# Altium schematic sheet Connectors.SchDoc
size B; Organization: Altium Limited; Address1: L3, 12a Rodborough Rd; Address2: Frenchs Forest; Address3: NSW; Address4: Australia 2086; SheetNumber: 7
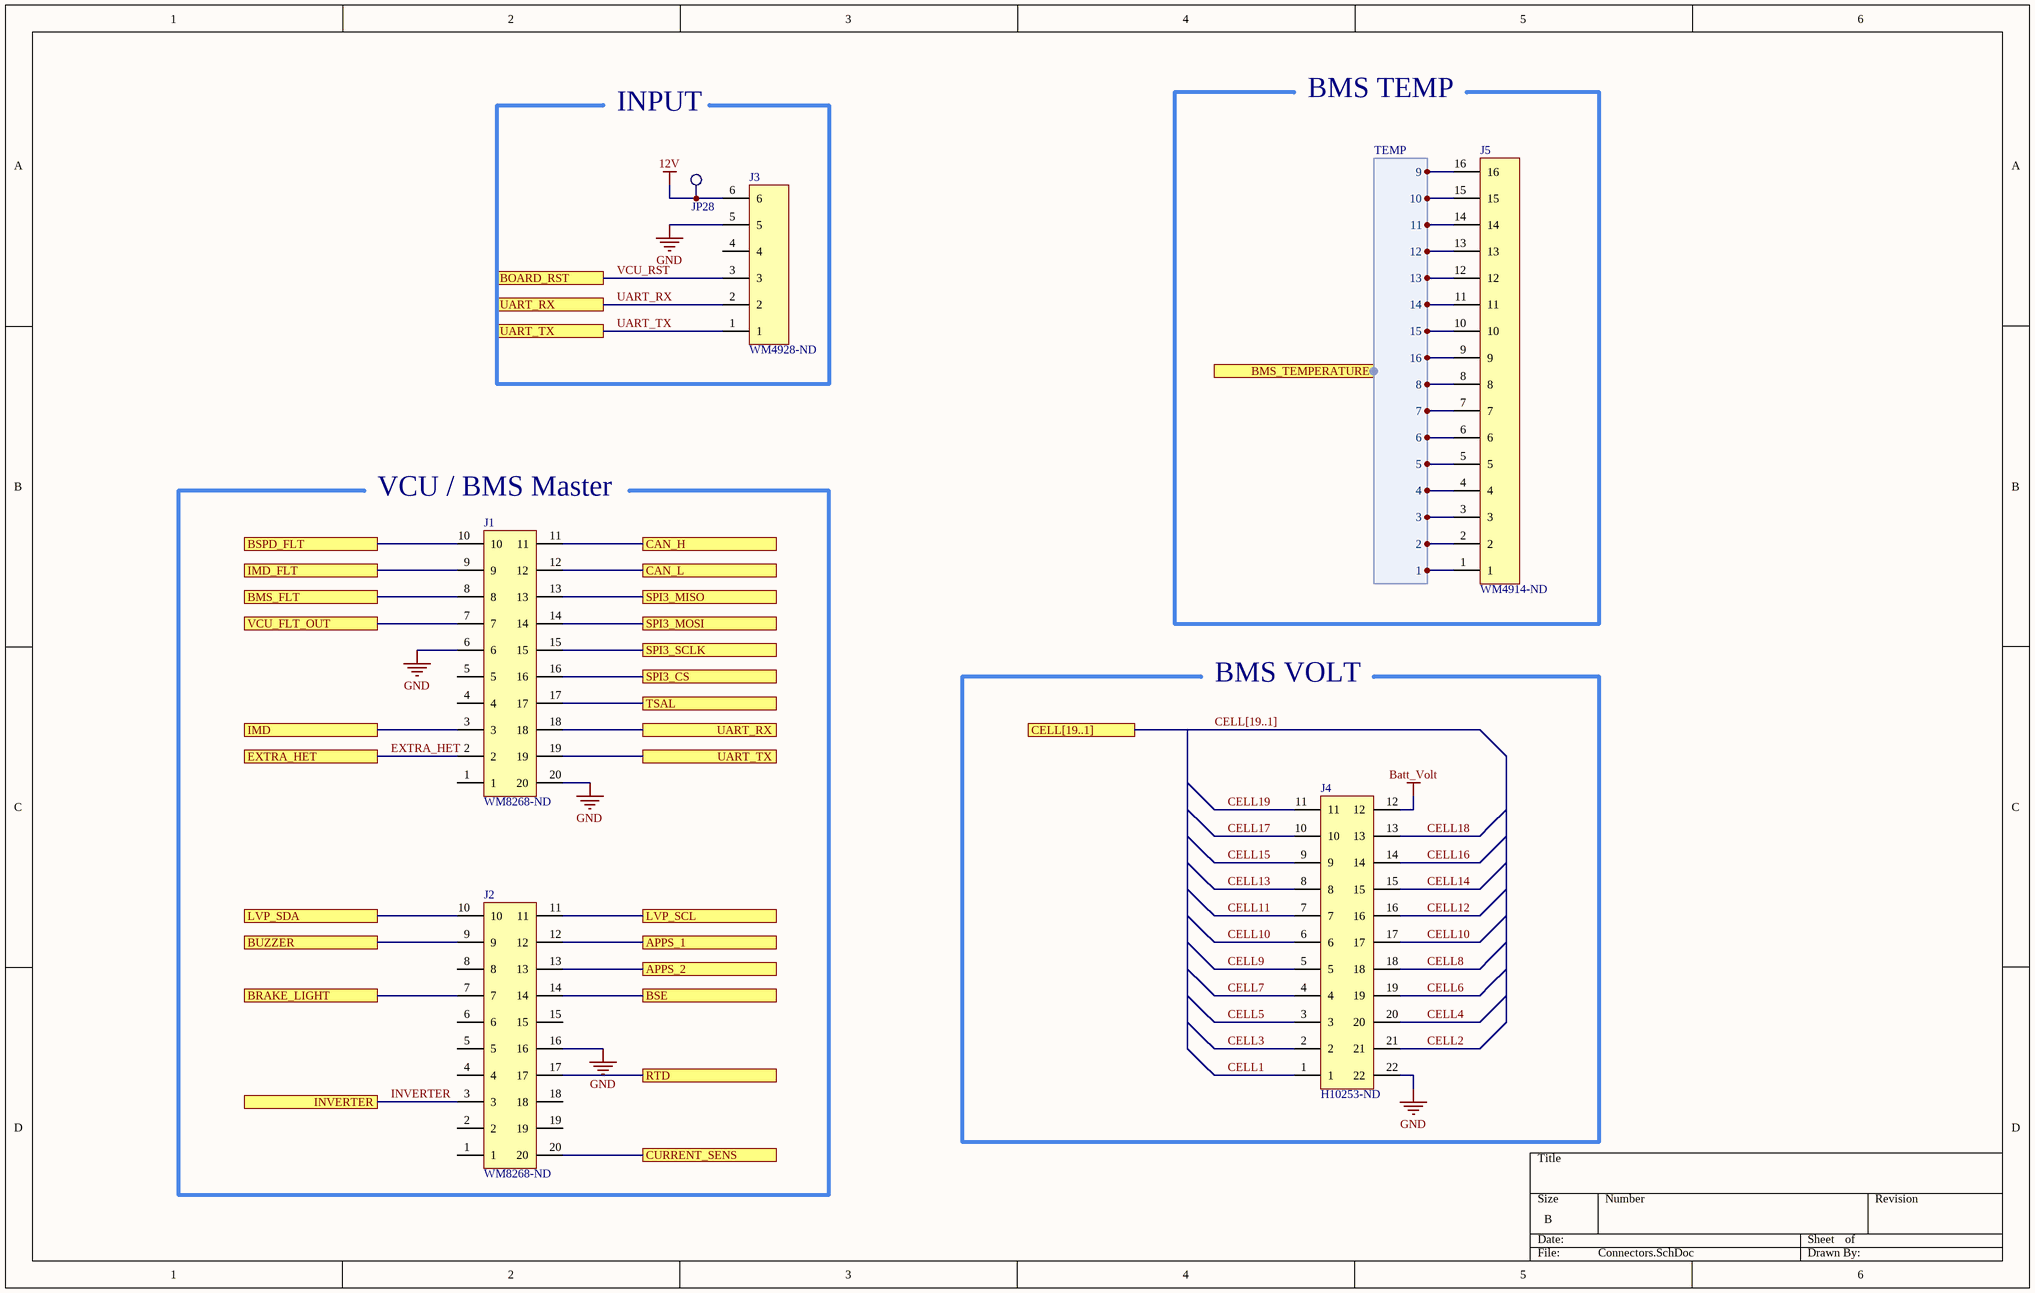
[diagram p0: Connectors.SchDoc]

## Parts
J1  WM8268-ND  [2X10PIN]
J2  WM8268-ND  [2X10PIN]
J3  WM4928-ND  [6PIN]
J4  H10253-ND  [2X11PIN]
J5  WM4914-ND  [16PIN]
JP28  Testpoint2  [TP2]  (value not drawn)

## Ports
APPS_1, APPS_2, BMS_FLT, BMS_TEMPERATURE (harness TEMP), BOARD_RST, BRAKE_LIGHT, BSE, BSPD_FLT, BUZZER, CAN_H, CAN_L, CELL[19..1], CURRENT_SENS, EXTRA_HET, IMD, IMD_FLT, INVERTER, LVP_SCL, LVP_SDA, RTD, SPI3_CS, SPI3_MISO, SPI3_MOSI, SPI3_SCLK, TSAL, UART_RX, UART_TX, VCU_FLT_OUT

## Harnesses
TEMP: 1, 2, 3, 4, 5, 6, 7, 8, 16, 15, 14, 13, 12, 11, 10, 9

## Nets
12V: J3.6 JP28.1
Batt_Volt: J4.12
GND: J1.6 J1.20 J2.16 J3.5 J4.22
APPS_1: J2.12 ; port APPS_1
APPS_2: J2.13 ; port APPS_2
BMS_FLT: J1.8 ; port BMS_FLT
BRAKE_LIGHT: J2.7 ; port BRAKE_LIGHT
BSE: J2.14 ; port BSE
BSPD_FLT: J1.10 ; port BSPD_FLT
BUZZER: J2.9 ; port BUZZER
CAN_H: J1.11 ; port CAN_H
CAN_L: J1.12 ; port CAN_L
CELL1: J4.1
CELL2: J4.21
CELL3: J4.2
CELL4: J4.20
CELL5: J4.3
CELL6: J4.19
CELL7: J4.4
CELL8: J4.18
CELL9: J4.5
CELL10: J4.6 J4.17
CELL11: J4.7
CELL12: J4.16
CELL13: J4.8
CELL14: J4.15
CELL15: J4.9
CELL16: J4.14
CELL17: J4.10
CELL18: J4.13
CELL19: J4.11
CURRENT_SENS: J2.20 ; port CURRENT_SENS
EXTRA_HET: J1.2 ; port EXTRA_HET
IMD: J1.3 ; port IMD
IMD_FLT: J1.9 ; port IMD_FLT
INVERTER: J2.3 ; port INVERTER
LVP_SCL: J2.11 ; port LVP_SCL
LVP_SDA: J2.10 ; port LVP_SDA
RTD: J2.17 ; port RTD
SPI3_CS: J1.16 ; port SPI3_CS
SPI3_MISO: J1.13 ; port SPI3_MISO
SPI3_MOSI: J1.14 ; port SPI3_MOSI
SPI3_SCLK: J1.15 ; port SPI3_SCLK
TSAL: J1.17 ; port TSAL
UART_RX: J1.18 J3.2 ; port UART_RX
UART_TX: J1.19 J3.1 ; port UART_TX
VCU_FLT_OUT: J1.7 ; port VCU_FLT_OUT
VCU_RST: J3.3 ; port BOARD_RST
NetJ5_1: J5.1 ; port BMS_TEMPERATURE.1
NetJ5_2: J5.2 ; port BMS_TEMPERATURE.2
NetJ5_3: J5.3 ; port BMS_TEMPERATURE.3
NetJ5_4: J5.4 ; port BMS_TEMPERATURE.4
NetJ5_5: J5.5 ; port BMS_TEMPERATURE.5
NetJ5_6: J5.6 ; port BMS_TEMPERATURE.6
NetJ5_7: J5.7 ; port BMS_TEMPERATURE.7
NetJ5_8: J5.8 ; port BMS_TEMPERATURE.8
NetJ5_9: J5.9 ; port BMS_TEMPERATURE.16
NetJ5_10: J5.10 ; port BMS_TEMPERATURE.15
NetJ5_11: J5.11 ; port BMS_TEMPERATURE.14
NetJ5_12: J5.12 ; port BMS_TEMPERATURE.13
NetJ5_13: J5.13 ; port BMS_TEMPERATURE.12
NetJ5_14: J5.14 ; port BMS_TEMPERATURE.11
NetJ5_15: J5.15 ; port BMS_TEMPERATURE.10
NetJ5_16: J5.16 ; port BMS_TEMPERATURE.9

Not connected (* = marked no-connect by the designer): J1 1 4 5; J2 1 2 4 5 6 8 15 18 19; J3 4

## Buses and harness runs
bus CELL[19..1] = port CELL[19..1]

## Notes on the sheet
- BMS TEMP
- INPUT
- (near J1) VCU / BMS Master
- BMS VOLT
- Title
- Size:
- Date:
- B
- Number:
- Time:
- Revision:
- Sheet
- of
- File:

## Library data of the parts
J1 J2 = 2X10PIN: CONN HEADER R/A 20POS 2.54MM; Manufacturer: Molex; Manufacturer Part Number: 0901303120; Max Voltage Rating (DC): 350V; Supplier 1: Digi-Key; Stock 1: 2147; Pricing 1: 1=2.41, 10=2.19, 100=1.877, 500=1.56416, 1000=1.3407, 5000=1.18875, 10000=1.16194 (USD); Housing Color: Black; Housing Material: Polyester; Contact Plating: Tin,Lead; Contact Material: Brass; Min Operating Temperature: -55°C; Max Operating Temperature: 125°C; Number of Rows: 2; Packaging: Tray; Termination: Solder; Orientation: Right Angle; Max Voltage Rating (AC): 350V; Length: 28.12mm; Pitch: 2.54mm; Depth: 9.75mm; Supplier Part Number 1: WM8268-ND
J3 = 6PIN: CONN HEADER R/A 6POS 2.54MM; Manufacturer: Molex; Manufacturer Part Number: 70553-0040; Contact Resistance: 30mR; Number of Positions: 6; Current Rating: 3A; Voltage Rating: 250V; Gender: Male; Insulation Resistance: 1GR; Glow Wire Compliant: Non-compliant; Supplier 1: Digi-Key; Stock 1: 2212; Pricing 1: 1=1.58, 10=1.434, 100=1.2289, 500=1.0241, 1000=0.8778, 5000=0.77832, 10000=0.76076 (USD); Mount: Through Hole; Contact Material: Bronze,Copper Alloy,Brass; Contact Plating: Tin; Housing Color: Black; Color: Black; Housing Material: Thermoplastic; Material: Brass; Min Operating Temperature: -40°C; Max Operating Temperature: 105°C; Number of Rows: 1; Packaging: Rail/Tube; Termination: Solder; Number of Contacts: 6; Orientation: Right Angle; Package Quantity: 1200; Max Current Rating: 3A; Max Voltage Rating (AC): 250V; Voltage Rating (DC): 250V; Number of Circuits: 6; Length: 17.79mm; Height: 6.99mm; Pitch: 2.54mm; Depth: 13.59mm; Radiation Hardening: No; REACH SVHC: Unknown; ELV: Compliant; Lead Free: Lead Free; Flammability Rating: UL94 V-0; ComponentLink1URL: http://uk.rs-online.com/webdocs/13c4/0900766b813c4993.pdf?src-supplier=RSComponents; ComponentLink1Description: http://uk.rs-online.com/webdocs/13c4/0900766b813c4993.pdf?src-supplier=RSComponents; ComponentLink2URL: http://www.molex.com/webdocs/datasheets/pdf/en-us/0705530040_PCB_HEADERS.pdf?src-supplier=Avnet+Europe; ComponentLink2Description: http://www.molex.com/webdocs/datasheets/pdf/en-us/0705530040_PCB_HEADERS.pdf?src-supplier=Avnet+Europe; ComponentLink3URL: http://www.farnell.com/datasheets/1844551.pdf?src-supplier=Farnell; ComponentLink3Description: http://www.farnell.com/datasheets/1844551.pdf?src-supplier=Farnell; ComponentLink4URL: http://www.mouser.com/ds/2/276/0705530040_PCB_HEADERS-172948.pdf?src-supplier=Mouser; ComponentLink4Description: http://www.mouser.com/ds/2/276/0705530040_PCB_HEADERS-172948.pdf?src-supplier=Mouser; ComponentLink5URL: http://www.farnell.com/cad/655744.pdf?src-supplier=Element14; ComponentLink5Description: http://www.farnell.com/cad/655744.pdf?src-supplier=Element14; ComponentLink6URL: http://www.jameco.com/Jameco/Products/ProdDS/1302975.pdf?src-supplier=Jameco; ComponentLink6Description: http://www.jameco.com/Jameco/Products/ProdDS/1302975.pdf?src-supplier=Jameco; Supplier Part Number 1: WM4928-ND
J4 = 2X11PIN: CONN HEADER R/A 22POS 2MM; Manufacturer: Hirose; Manufacturer Part Number: DF11-22DP-2DS(24); Number of Positions: 22; Connector Type: Male Pin; Gender: Male; Current Rating: 2A; Voltage Rating: 250V; Contact Resistance: 30mR; Row Spacing: 0.079inch; Supplier 1: Digi-Key; Stock 1: 2198; Pricing 1: 1=1.19, 10=1.046, 100=0.902, 500=0.738, 1000=0.656, 5000=0.574, 10000=0.5453 (USD); Mount: Through Hole; Contact Material: Brass,Copper Alloy,Tin; Color: Black; Contact Plating: Tin; Housing Color: Black; Housing Material: Polyamide; Min Operating Temperature: -30°C; Max Operating Temperature: 85°C; Number of Rows: 2; Packaging: Rail/Tube; Package Quantity: 20; Termination: Solder; Number of Contacts: 22; Orientation: Right Angle; Max Current Rating: 2A; Fastening Type: Detent; Length: 24mm; Height: 5mm; Pitch: 2mm; Depth: 10mm; Contact Mating Length: 0.118inch; Radiation Hardening: No; Lead Free: Lead Free; ComponentLink1URL: http://docs-usa.electrocomponents.com/techlib:/itc_doclist_US.htm?stockno=6888963&src-supplier=Allied+Electronics; ComponentLink1Description: http://docs-usa.electrocomponents.com/techlib:/itc_doclist_US.htm?stockno=6888963&src-supplier=Allied+Electronics; ComponentLink2URL: https://www.verical.com/server-webapp/html/getDatasheet?partID=456315&src-supplier=Verical; ComponentLink2Description: https://www.verical.com/server-webapp/html/getDatasheet?partID=456315&src-supplier=Verical; ComponentLink3URL: http://www.hirose.co.jp/cataloge_hp/en_DF11_20130411.pdf?src-supplier=Future+Electronics; ComponentLink3Description: http://www.hirose.co.jp/cataloge_hp/en_DF11_20130411.pdf?src-supplier=Future+Electronics; ComponentLink4URL: http://www.farnell.com/datasheets/91550.pdf?src-supplier=Element14; ComponentLink4Description: http://www.farnell.com/datasheets/91550.pdf?src-supplier=Element14; ComponentLink5URL: http://www.mouser.com/ds/2/185/DF11_catalog-1064296.pdf?src-supplier=Mouser; ComponentLink5Description: http://www.mouser.com/ds/2/185/DF11_catalog-1064296.pdf?src-supplier=Mouser; ComponentLink6URL: http://documents.rs-components.com/techlib://itc_doclist_GB.htm?stockno=6056598&src-supplier=RSComponents; ComponentLink6Description: http://documents.rs-components.com/techlib://itc_doclist_GB.htm?stockno=6056598&src-supplier=RSComponents; Supplier Part Number 1: H10253-ND
J5 = 16PIN: CONN HEADER R/A 16POS 2.54MM; Manufacturer: Molex; Manufacturer Part Number: 0705530015; Number of Positions: 16; Connector Type: Male Pin; Contact Resistance: 30mR; Pitch: 0.1inch; Supplier 1: Digi-Key; Stock 1: 225; Pricing 1: 1=8.86, 10=8.47, 100=7.1225, 500=5.9675, 1000=5.2745 (USD); Mount: Through Hole; Housing Material: Polyester; Contact Plating: Gold; Contact Material: Bronze; Color: Black; Housing Color: Black; Min Operating Temperature: -40°C; Max Operating Temperature: 105°C; Packaging: Rail/Tube; Number of Rows: 1; Termination: Solder; Orientation: Right Angle; Length: 43.19mm; Depth: 13.59mm; Contact Mating Length: 0.24inch; Radiation Hardening: No; ComponentLink1URL: http://www.molex.com/pdm_docs/sd/705530015_sd.pdf?src-supplier=Digi-Key; ComponentLink1Description: http://www.molex.com/pdm_docs/sd/705530015_sd.pdf?src-supplier=Digi-Key; ComponentLink2URL: http://www.molex.com/webdocs/datasheets/pdf/en-us/0705530015_PCB_HEADERS.pdf?src-supplier=Avnet; ComponentLink2Description: http://www.molex.com/webdocs/datasheets/pdf/en-us/0705530015_PCB_HEADERS.pdf?src-supplier=Avnet; Supplier Part Number 1: WM4914-ND
JP28 = Testpoint2: Single layer pad TP